# Altium project PCB-Relay-Board-V1.PrjPcb (part 1 of 3)
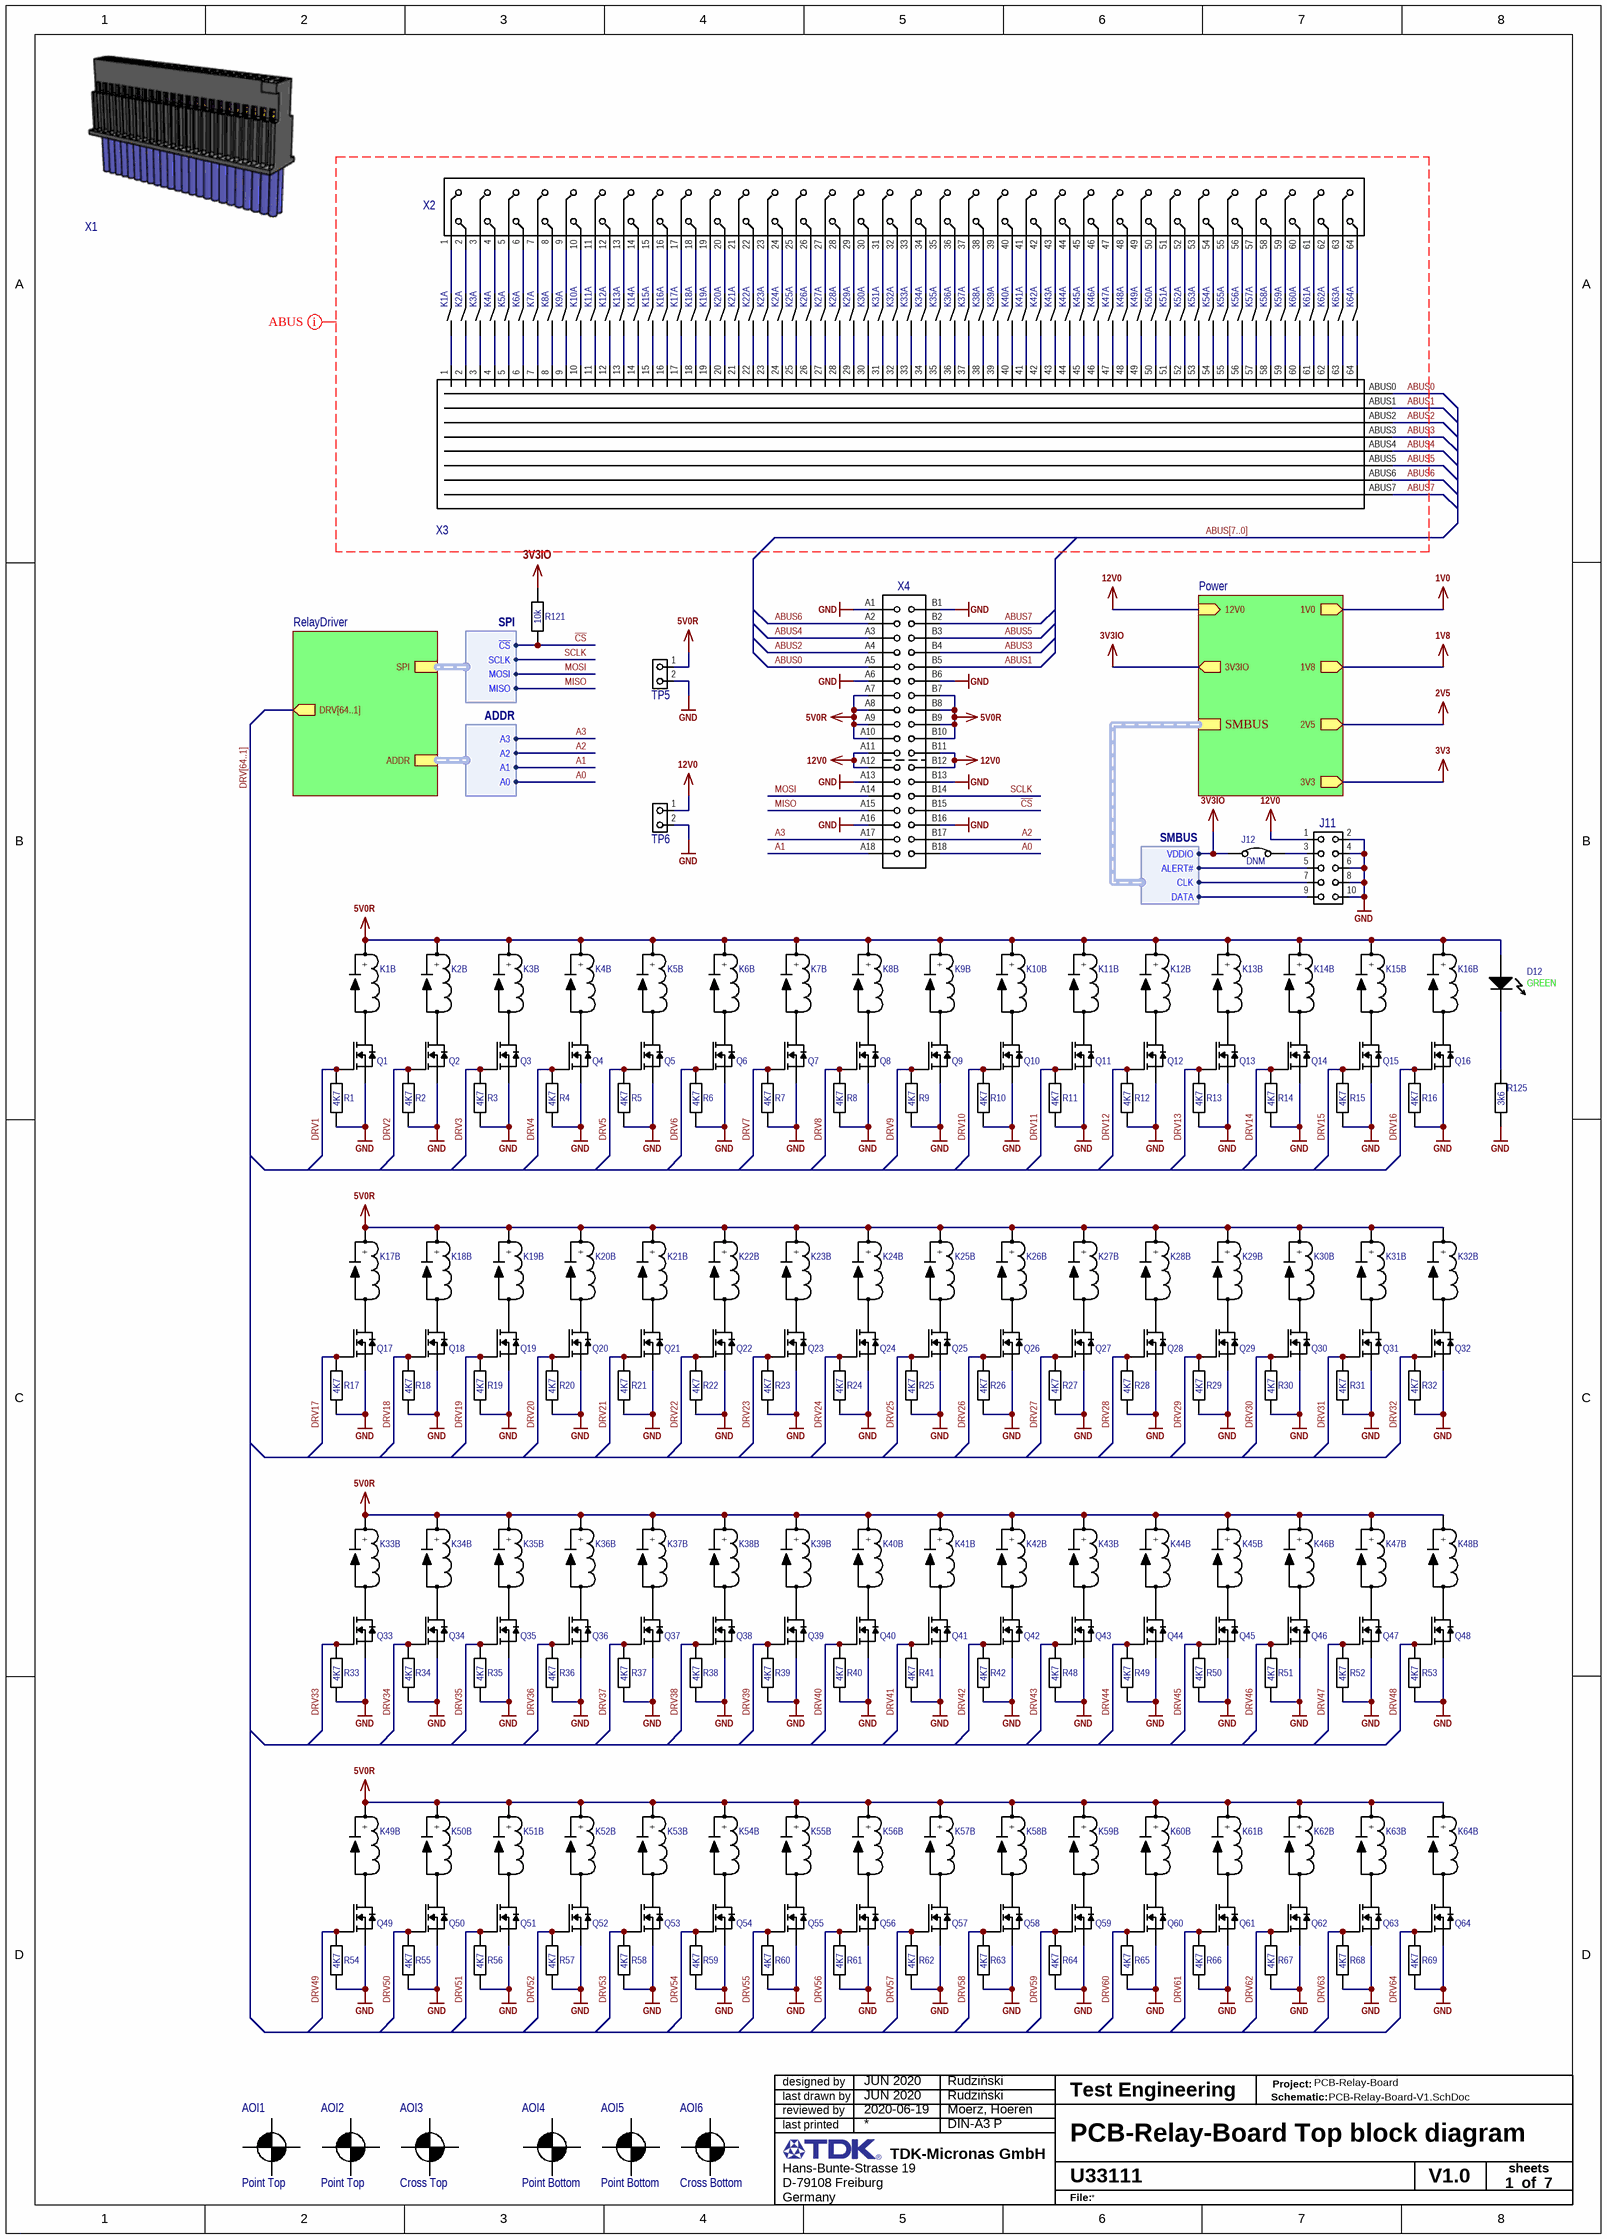
[diagram p0: PCB-Relay-Board-V1.SchDoc]
A_Number: PCB-Tester; Board: PCB-Relay-Board; CheckedBy: Mörz; DocumentNumber: U33111; DrawnBy: Rudziński; Engineer: Hören; MajorRevision: 1; MinorRevision: 0; Project: PCB-Relay-Board; Project_Name: PCB-Relay-Board; Project_Number: U33111; Revision: V1.0; Team: Test Engineering; U_Number: U33111
7 sheets, 429 parts. Net scope: hierarchical (ports join the sheet entries above them; power ports are global).
Board file: PCB-Relay-Board-V1.PcbDoc
Sheets:
  PCB-Relay-Board-V1.SchDoc
    Power = Power.SchDoc
    RelayDriver = RelayDriver.SchDoc
      X7A15T-Prog = X7A15T-Prog.SchDoc
      X7A15T-Fabric = X7A15T-Fabric.SchDoc
      X7A15T-Power = X7A15T-Power.SchDoc
        X7A15T-Decoupling = X7A15T-Decoupling.SchDoc

## Sheet PCB-Relay-Board-V1.SchDoc: PCB-Relay-Board Top block diagram
size A3 portrait; Date: JUN 2020; CheckedBy: Moerz, Hoeren; Author: Rudziński; CompanyName: TDK-Micronas GmbH; DrawnBy: Rudziński; Engineer: Rudziński; Organization: Test Engineering; Address1: Hans-Bunte-Strasse 19; Address2: D-79108 Freiburg; Address3: Germany; DocumentNumber: U33111; Revision: V1.0; SheetNumber: 1; SheetTotal: 7; DateDraw: JUN 2020; DateChecked: 2020-06-19; Workspace: Workspace; TitleTyp: Title-Typ; PageSetup: Record=PageOptions|CenterHorizontal=True|CenterVertical=True|PrintScale=0.97|XCorrection=1.00|YCorrection=1.00|PrintKind=0|BorderSize=5000000|LeftOffset=0|BottomOffset=0|Orientation=2|PaperLength=1000|PaperWidth=1000|Scale=100|PaperSource=7|PrintQuality=-3|MediaType=1|DitherType=10|PrintScaleMode=1|PaperKind=A4|PaperIndex=9

### Parts
AOI1  Shape: Point Top  [Fiducial Point]  (hidden comment: AOI)  (no BOM)
AOI2  Shape: Point Top  [Fiducial Point]  (hidden comment: AOI)  (no BOM)
AOI3  Shape: Cross Top  [Fiducial Cross]  (hidden comment: AOI)  (no BOM)
AOI4  Shape: Point Bottom  [Fiducial Point]  (hidden comment: AOI)  (no BOM)
AOI5  Shape: Point Bottom  [Fiducial Point]  (hidden comment: AOI)  (no BOM)
AOI6  Shape: Cross Bottom  [Fiducial Cross]  (hidden comment: AOI)  (no BOM)
D12  Color: GREEN  [L0603G]  (hidden comment: D)
J11  J  [Header 100mil 5x2]  (value not drawn)
J12  value DNM  [JumperSMD]  (hidden comment: J)  (no BOM)
K1  K  [118-1A]  (value not drawn)  (parts A,B of 2)
K2  K  [118-1A]  (value not drawn)  (parts A,B of 2)
K3  K  [118-1A]  (value not drawn)  (parts A,B of 2)
K4  K  [118-1A]  (value not drawn)  (parts A,B of 2)
K5  K  [118-1A]  (value not drawn)  (parts A,B of 2)
K6  K  [118-1A]  (value not drawn)  (parts A,B of 2)
K7  K  [118-1A]  (value not drawn)  (parts A,B of 2)
K8  K  [118-1A]  (value not drawn)  (parts A,B of 2)
K9  K  [118-1A]  (value not drawn)  (parts A,B of 2)
K10  K  [118-1A]  (value not drawn)  (parts A,B of 2)
K11  K  [118-1A]  (value not drawn)  (parts A,B of 2)
K12  K  [118-1A]  (value not drawn)  (parts A,B of 2)
K13  K  [118-1A]  (value not drawn)  (parts A,B of 2)
K14  K  [118-1A]  (value not drawn)  (parts A,B of 2)
K15  K  [118-1A]  (value not drawn)  (parts A,B of 2)
K16  K  [118-1A]  (value not drawn)  (parts A,B of 2)
K17  K  [118-1A]  (value not drawn)  (parts A,B of 2)
K18  K  [118-1A]  (value not drawn)  (parts A,B of 2)
K19  K  [118-1A]  (value not drawn)  (parts A,B of 2)
K20  K  [118-1A]  (value not drawn)  (parts A,B of 2)
K21  K  [118-1A]  (value not drawn)  (parts A,B of 2)
K22  K  [118-1A]  (value not drawn)  (parts A,B of 2)
K23  K  [118-1A]  (value not drawn)  (parts A,B of 2)
K24  K  [118-1A]  (value not drawn)  (parts A,B of 2)
K25  K  [118-1A]  (value not drawn)  (parts A,B of 2)
K26  K  [118-1A]  (value not drawn)  (parts A,B of 2)
K27  K  [118-1A]  (value not drawn)  (parts A,B of 2)
K28  K  [118-1A]  (value not drawn)  (parts A,B of 2)
K29  K  [118-1A]  (value not drawn)  (parts A,B of 2)
K30  K  [118-1A]  (value not drawn)  (parts A,B of 2)
K31  K  [118-1A]  (value not drawn)  (parts A,B of 2)
K32  K  [118-1A]  (value not drawn)  (parts A,B of 2)
K33  K  [118-1A]  (value not drawn)  (parts A,B of 2)
K34  K  [118-1A]  (value not drawn)  (parts A,B of 2)
K35  K  [118-1A]  (value not drawn)  (parts A,B of 2)
K36  K  [118-1A]  (value not drawn)  (parts A,B of 2)
K37  K  [118-1A]  (value not drawn)  (parts A,B of 2)
K38  K  [118-1A]  (value not drawn)  (parts A,B of 2)
K39  K  [118-1A]  (value not drawn)  (parts A,B of 2)
K40  K  [118-1A]  (value not drawn)  (parts A,B of 2)
K41  K  [118-1A]  (value not drawn)  (parts A,B of 2)
K42  K  [118-1A]  (value not drawn)  (parts A,B of 2)
K43  K  [118-1A]  (value not drawn)  (parts A,B of 2)
K44  K  [118-1A]  (value not drawn)  (parts A,B of 2)
K45  K  [118-1A]  (value not drawn)  (parts A,B of 2)
K46  K  [118-1A]  (value not drawn)  (parts A,B of 2)
K47  K  [118-1A]  (value not drawn)  (parts A,B of 2)
K48  K  [118-1A]  (value not drawn)  (parts A,B of 2)
K49  K  [118-1A]  (value not drawn)  (parts A,B of 2)
K50  K  [118-1A]  (value not drawn)  (parts A,B of 2)
K51  K  [118-1A]  (value not drawn)  (parts A,B of 2)
K52  K  [118-1A]  (value not drawn)  (parts A,B of 2)
K53  K  [118-1A]  (value not drawn)  (parts A,B of 2)
K54  K  [118-1A]  (value not drawn)  (parts A,B of 2)
K55  K  [118-1A]  (value not drawn)  (parts A,B of 2)
K56  K  [118-1A]  (value not drawn)  (parts A,B of 2)
K57  K  [118-1A]  (value not drawn)  (parts A,B of 2)
K58  K  [118-1A]  (value not drawn)  (parts A,B of 2)
K59  K  [118-1A]  (value not drawn)  (parts A,B of 2)
K60  K  [118-1A]  (value not drawn)  (parts A,B of 2)
K61  K  [118-1A]  (value not drawn)  (parts A,B of 2)
K62  K  [118-1A]  (value not drawn)  (parts A,B of 2)
K63  K  [118-1A]  (value not drawn)  (parts A,B of 2)
K64  K  [118-1A]  (value not drawn)  (parts A,B of 2)
Q1  Q  [SOT23-3]  (value not drawn)
Q2  Q  [SOT23-3]  (value not drawn)
Q3  Q  [SOT23-3]  (value not drawn)
Q4  Q  [SOT23-3]  (value not drawn)
Q5  Q  [SOT23-3]  (value not drawn)
Q6  Q  [SOT23-3]  (value not drawn)
Q7  Q  [SOT23-3]  (value not drawn)
Q8  Q  [SOT23-3]  (value not drawn)
Q9  Q  [SOT23-3]  (value not drawn)
Q10  Q  [SOT23-3]  (value not drawn)
Q11  Q  [SOT23-3]  (value not drawn)
Q12  Q  [SOT23-3]  (value not drawn)
Q13  Q  [SOT23-3]  (value not drawn)
Q14  Q  [SOT23-3]  (value not drawn)
Q15  Q  [SOT23-3]  (value not drawn)
Q16  Q  [SOT23-3]  (value not drawn)
Q17  Q  [SOT23-3]  (value not drawn)
Q18  Q  [SOT23-3]  (value not drawn)
Q19  Q  [SOT23-3]  (value not drawn)
Q20  Q  [SOT23-3]  (value not drawn)
Q21  Q  [SOT23-3]  (value not drawn)
Q22  Q  [SOT23-3]  (value not drawn)
Q23  Q  [SOT23-3]  (value not drawn)
Q24  Q  [SOT23-3]  (value not drawn)
Q25  Q  [SOT23-3]  (value not drawn)
Q26  Q  [SOT23-3]  (value not drawn)
Q27  Q  [SOT23-3]  (value not drawn)
Q28  Q  [SOT23-3]  (value not drawn)
Q29  Q  [SOT23-3]  (value not drawn)
Q30  Q  [SOT23-3]  (value not drawn)
Q31  Q  [SOT23-3]  (value not drawn)
Q32  Q  [SOT23-3]  (value not drawn)
Q33  Q  [SOT23-3]  (value not drawn)
Q34  Q  [SOT23-3]  (value not drawn)
Q35  Q  [SOT23-3]  (value not drawn)
Q36  Q  [SOT23-3]  (value not drawn)
Q37  Q  [SOT23-3]  (value not drawn)
Q38  Q  [SOT23-3]  (value not drawn)
Q39  Q  [SOT23-3]  (value not drawn)
Q40  Q  [SOT23-3]  (value not drawn)
Q41  Q  [SOT23-3]  (value not drawn)
Q42  Q  [SOT23-3]  (value not drawn)
Q43  Q  [SOT23-3]  (value not drawn)
Q44  Q  [SOT23-3]  (value not drawn)
Q45  Q  [SOT23-3]  (value not drawn)
Q46  Q  [SOT23-3]  (value not drawn)
Q47  Q  [SOT23-3]  (value not drawn)
Q48  Q  [SOT23-3]  (value not drawn)
Q49  Q  [SOT23-3]  (value not drawn)
Q50  Q  [SOT23-3]  (value not drawn)
Q51  Q  [SOT23-3]  (value not drawn)
Q52  Q  [SOT23-3]  (value not drawn)
Q53  Q  [SOT23-3]  (value not drawn)
Q54  Q  [SOT23-3]  (value not drawn)
Q55  Q  [SOT23-3]  (value not drawn)
Q56  Q  [SOT23-3]  (value not drawn)
Q57  Q  [SOT23-3]  (value not drawn)
Q58  Q  [SOT23-3]  (value not drawn)
Q59  Q  [SOT23-3]  (value not drawn)
Q60  Q  [SOT23-3]  (value not drawn)
Q61  Q  [SOT23-3]  (value not drawn)
Q62  Q  [SOT23-3]  (value not drawn)
Q63  Q  [SOT23-3]  (value not drawn)
Q64  Q  [SOT23-3]  (value not drawn)
R1  value 4K7  [R0402 Reflow]  (hidden comment: R)
R2  value 4K7  [R0402 Reflow]  (hidden comment: R)
R3  value 4K7  [R0402 Reflow]  (hidden comment: R)
R4  value 4K7  [R0402 Reflow]  (hidden comment: R)
R5  value 4K7  [R0402 Reflow]  (hidden comment: R)
R6  value 4K7  [R0402 Reflow]  (hidden comment: R)
R7  value 4K7  [R0402 Reflow]  (hidden comment: R)
R8  value 4K7  [R0402 Reflow]  (hidden comment: R)
R9  value 4K7  [R0402 Reflow]  (hidden comment: R)
R10  value 4K7  [R0402 Reflow]  (hidden comment: R)
R11  value 4K7  [R0402 Reflow]  (hidden comment: R)
R12  value 4K7  [R0402 Reflow]  (hidden comment: R)
R13  value 4K7  [R0402 Reflow]  (hidden comment: R)
R14  value 4K7  [R0402 Reflow]  (hidden comment: R)
R15  value 4K7  [R0402 Reflow]  (hidden comment: R)
R16  value 4K7  [R0402 Reflow]  (hidden comment: R)
R17  value 4K7  [R0402 Reflow]  (hidden comment: R)
R18  value 4K7  [R0402 Reflow]  (hidden comment: R)
R19  value 4K7  [R0402 Reflow]  (hidden comment: R)
R20  value 4K7  [R0402 Reflow]  (hidden comment: R)
R21  value 4K7  [R0402 Reflow]  (hidden comment: R)
R22  value 4K7  [R0402 Reflow]  (hidden comment: R)
R23  value 4K7  [R0402 Reflow]  (hidden comment: R)
R24  value 4K7  [R0402 Reflow]  (hidden comment: R)
R25  value 4K7  [R0402 Reflow]  (hidden comment: R)
R26  value 4K7  [R0402 Reflow]  (hidden comment: R)
R27  value 4K7  [R0402 Reflow]  (hidden comment: R)
R28  value 4K7  [R0402 Reflow]  (hidden comment: R)
R29  value 4K7  [R0402 Reflow]  (hidden comment: R)
R30  value 4K7  [R0402 Reflow]  (hidden comment: R)
R31  value 4K7  [R0402 Reflow]  (hidden comment: R)
R32  value 4K7  [R0402 Reflow]  (hidden comment: R)
R33  value 4K7  [R0402 Reflow]  (hidden comment: R)
R34  value 4K7  [R0402 Reflow]  (hidden comment: R)
R35  value 4K7  [R0402 Reflow]  (hidden comment: R)
R36  value 4K7  [R0402 Reflow]  (hidden comment: R)
R37  value 4K7  [R0402 Reflow]  (hidden comment: R)
R38  value 4K7  [R0402 Reflow]  (hidden comment: R)
R39  value 4K7  [R0402 Reflow]  (hidden comment: R)
R40  value 4K7  [R0402 Reflow]  (hidden comment: R)
R41  value 4K7  [R0402 Reflow]  (hidden comment: R)
R42  value 4K7  [R0402 Reflow]  (hidden comment: R)
R48  value 4K7  [R0402 Reflow]  (hidden comment: R)
R49  value 4K7  [R0402 Reflow]  (hidden comment: R)
R50  value 4K7  [R0402 Reflow]  (hidden comment: R)
R51  value 4K7  [R0402 Reflow]  (hidden comment: R)
R52  value 4K7  [R0402 Reflow]  (hidden comment: R)
R53  value 4K7  [R0402 Reflow]  (hidden comment: R)
R54  value 4K7  [R0402 Reflow]  (hidden comment: R)
R55  value 4K7  [R0402 Reflow]  (hidden comment: R)
R56  value 4K7  [R0402 Reflow]  (hidden comment: R)
R57  value 4K7  [R0402 Reflow]  (hidden comment: R)
R58  value 4K7  [R0402 Reflow]  (hidden comment: R)
R59  value 4K7  [R0402 Reflow]  (hidden comment: R)
R60  value 4K7  [R0402 Reflow]  (hidden comment: R)
R61  value 4K7  [R0402 Reflow]  (hidden comment: R)
R62  value 4K7  [R0402 Reflow]  (hidden comment: R)
R63  value 4K7  [R0402 Reflow]  (hidden comment: R)
R64  value 4K7  [R0402 Reflow]  (hidden comment: R)
R65  value 4K7  [R0402 Reflow]  (hidden comment: R)
R66  value 4K7  [R0402 Reflow]  (hidden comment: R)
R67  value 4K7  [R0402 Reflow]  (hidden comment: R)
R68  value 4K7  [R0402 Reflow]  (hidden comment: R)
R69  value 4K7  [R0402 Reflow]  (hidden comment: R)
R121  value 10k  [R0402 Reflow]  (hidden comment: R)
R125  value 3k6  [R0603 Reflow]  (hidden comment: R)
TP5  TP  [DualTestpoint 100mils]  (value not drawn)  (no BOM)
TP6  TP  [DualTestpoint 100mils]  (value not drawn)  (no BOM)
X1  X  (value not drawn)
X2  X  [TFC-132-01-F-D-RA]  (value not drawn)
X3  X  [CONFIG64]  (value not drawn)  (no BOM)
X4  X  [PCIE-036-02-F-D-Fingers]  (value not drawn)  (no BOM)

### Sub-sheets
Power = Power.SchDoc: 2V5 (out), 3V3 (out), 12V0 (in), 1V0 (out), 1V8 (out), SMBUS (harness SMBUS), 3V3IO (out)
RelayDriver = RelayDriver.SchDoc: SPI (harness SPI), ADDR (harness ADDR), DRV[64..1] (out)

### Harnesses
SPI: MISO, MOSI, SCLK, ~{CS}
ADDR: A3, A2, A1, A0
SMBUS: ALERT#, CLK, DATA, VDDIO

### Nets
3V3IO: J12.1 R121.2 ; sheet Power/3V3IO, sheet Power/SMBUS.VDDIO
5V0R: D12.1(Anode) K1.1(+) K2.1(+) K3.1(+) K4.1(+) K5.1(+) K6.1(+) K7.1(+) K8.1(+) K9.1(+) K10.1(+) K11.1(+) K12.1(+) K13.1(+) K14.1(+) K15.1(+) K16.1(+) K17.1(+) K18.1(+) K19.1(+) K20.1(+) K21.1(+) K22.1(+) K23.1(+) K24.1(+) K25.1(+) K26.1(+) K27.1(+) K28.1(+) K29.1(+) K30.1(+) K31.1(+) K32.1(+) K33.1(+) K34.1(+) K35.1(+) K36.1(+) K37.1(+) K38.1(+) K39.1(+) K40.1(+) K41.1(+) K42.1(+) K43.1(+) K44.1(+) K45.1(+) K46.1(+) K47.1(+) K48.1(+) K49.1(+) K50.1(+) K51.1(+) K52.1(+) K53.1(+) K54.1(+) K55.1(+) K56.1(+) K57.1(+) K58.1(+) K59.1(+) K60.1(+) K61.1(+) K62.1(+) K63.1(+) K64.1(+) TP5.1 X4.A7 X4.A8 X4.A9 X4.A10 X4.B7 X4.B8 X4.B9 X4.B10
12V0: J11.1 TP6.1 X4.A11 X4.A12 X4.B11 X4.B12 ; sheet Power/12V0
GND: J11.2 J11.4 J11.6 J11.8 J11.10 Q1.2(S) Q2.2(S) Q3.2(S) Q4.2(S) Q5.2(S) Q6.2(S) Q7.2(S) Q8.2(S) Q9.2(S) Q10.2(S) Q11.2(S) Q12.2(S) Q13.2(S) Q14.2(S) Q15.2(S) Q16.2(S) Q17.2(S) Q18.2(S) Q19.2(S) Q20.2(S) Q21.2(S) Q22.2(S) Q23.2(S) Q24.2(S) Q25.2(S) Q26.2(S) Q27.2(S) Q28.2(S) Q29.2(S) Q30.2(S) Q31.2(S) Q32.2(S) Q33.2(S) Q34.2(S) Q35.2(S) Q36.2(S) Q37.2(S) Q38.2(S) Q39.2(S) Q40.2(S) Q41.2(S) Q42.2(S) Q43.2(S) Q44.2(S) Q45.2(S) Q46.2(S) Q47.2(S) Q48.2(S) Q49.2(S) Q50.2(S) Q51.2(S) Q52.2(S) Q53.2(S) Q54.2(S) Q55.2(S) Q56.2(S) Q57.2(S) Q58.2(S) Q59.2(S) Q60.2(S) Q61.2(S) Q62.2(S) Q63.2(S) Q64.2(S) R1.1 R2.1 R3.1 R4.1 R5.1 R6.1 R7.1 R8.1 R9.1 R10.1 R11.1 R12.1 R13.1 R14.1 R15.1 R16.1 R17.1 R18.1 R19.1 R20.1 R21.1 R22.1 R23.1 R24.1 R25.1 R26.1 R27.1 R28.1 R29.1 R30.1 R31.1 R32.1 R33.1 R34.1 R35.1 R36.1 R37.1 R38.1 R39.1 R40.1 R41.1 R42.1 R48.1 R49.1 R50.1 R51.1 R52.1 R53.1 R54.1 R55.1 R56.1 R57.1 R58.1 R59.1 R60.1 R61.1 R62.1 R63.1 R64.1 R65.1 R66.1 R67.1 R68.1 R69.1 R125.1 TP5.2 TP6.2 X4.A1 X4.A6 X4.A13 X4.A16 X4.B1 X4.B6 X4.B13 X4.B16
~{CS}: R121.1 X4.B15 ; sheet RelayDriver/SPI.~{CS}
A0: X4.B18 ; sheet RelayDriver/ADDR.A0
A1: X4.A18 ; sheet RelayDriver/ADDR.A1
A2: X4.B17 ; sheet RelayDriver/ADDR.A2
A3: X4.A17 ; sheet RelayDriver/ADDR.A3
ABUS0: X3.ABUS0 X4.A5  [project net ABUS0_1]
ABUS1: X3.ABUS1 X4.B5  [project net ABUS1_1]
ABUS2: X3.ABUS2 X4.A4  [project net ABUS2_1]
ABUS3: X3.ABUS3 X4.B4  [project net ABUS3_1]
ABUS4: X3.ABUS4 X4.A3  [project net ABUS4_1]
ABUS5: X3.ABUS5 X4.B3  [project net ABUS5_1]
ABUS6: X3.ABUS6 X4.A2  [project net ABUS6_1]
ABUS7: X3.ABUS7 X4.B2  [project net ABUS7_1]
DRV1: Q1.1(G) R1.2
DRV2: Q2.1(G) R2.2
DRV3: Q3.1(G) R3.2
DRV4: Q4.1(G) R4.2
DRV5: Q5.1(G) R5.2
DRV6: Q6.1(G) R6.2
DRV7: Q7.1(G) R7.2
DRV8: Q8.1(G) R8.2
DRV9: Q9.1(G) R9.2
DRV10: Q10.1(G) R10.2
DRV11: Q11.1(G) R11.2
DRV12: Q12.1(G) R12.2
DRV13: Q13.1(G) R13.2
DRV14: Q14.1(G) R14.2
DRV15: Q15.1(G) R15.2
DRV16: Q16.1(G) R16.2
DRV17: Q17.1(G) R17.2
DRV18: Q18.1(G) R18.2
DRV19: Q19.1(G) R19.2
DRV20: Q20.1(G) R20.2
DRV21: Q21.1(G) R21.2
DRV22: Q22.1(G) R22.2
DRV23: Q23.1(G) R23.2
DRV24: Q24.1(G) R24.2
DRV25: Q25.1(G) R25.2
DRV26: Q26.1(G) R26.2
DRV27: Q27.1(G) R27.2
DRV28: Q28.1(G) R28.2
DRV29: Q29.1(G) R29.2
DRV30: Q30.1(G) R30.2
DRV31: Q31.1(G) R31.2
DRV32: Q32.1(G) R32.2
DRV33: Q33.1(G) R33.2
DRV34: Q34.1(G) R34.2
DRV35: Q35.1(G) R35.2
DRV36: Q36.1(G) R36.2
DRV37: Q37.1(G) R37.2
DRV38: Q38.1(G) R38.2
DRV39: Q39.1(G) R39.2
DRV40: Q40.1(G) R40.2
DRV41: Q41.1(G) R41.2
DRV42: Q42.1(G) R42.2
DRV43: Q43.1(G) R48.2
DRV44: Q44.1(G) R49.2
DRV45: Q45.1(G) R50.2
DRV46: Q46.1(G) R51.2
DRV47: Q47.1(G) R52.2
DRV48: Q48.1(G) R53.2
DRV49: Q49.1(G) R54.2
DRV50: Q50.1(G) R55.2
DRV51: Q51.1(G) R56.2
DRV52: Q52.1(G) R57.2
DRV53: Q53.1(G) R58.2
DRV54: Q54.1(G) R59.2
DRV55: Q55.1(G) R60.2
DRV56: Q56.1(G) R61.2
DRV57: Q57.1(G) R62.2
DRV58: Q58.1(G) R63.2
DRV59: Q59.1(G) R64.2
DRV60: Q60.1(G) R65.2
DRV61: Q61.1(G) R66.2
DRV62: Q62.1(G) R67.2
DRV63: Q63.1(G) R68.2
DRV64: Q64.1(G) R69.2
MISO: X4.A15 ; sheet RelayDriver/SPI.MISO
MOSI: X4.A14 ; sheet RelayDriver/SPI.MOSI
SCLK: X4.B14 ; sheet RelayDriver/SPI.SCLK
NetD12_2: D12.2(Cathode) R125.2
NetJ11_3: J11.3 J12.2
NetJ11_5: J11.5 ; sheet Power/SMBUS.ALERT#
NetJ11_7: J11.7 ; sheet Power/SMBUS.CLK
NetJ11_9: J11.9 ; sheet Power/SMBUS.DATA
NetK1_2: K1.2(-) Q1.3(D)
NetK1_3: K1.3(CA) X3.1
NetK1_4: K1.4(CB) X2.1
NetK2_2: K2.2(-) Q2.3(D)
NetK2_3: K2.3(CA) X3.2
NetK2_4: K2.4(CB) X2.2
NetK3_2: K3.2(-) Q3.3(D)
NetK3_3: K3.3(CA) X3.3
NetK3_4: K3.4(CB) X2.3
NetK4_2: K4.2(-) Q4.3(D)
NetK4_3: K4.3(CA) X3.4
NetK4_4: K4.4(CB) X2.4
NetK5_2: K5.2(-) Q5.3(D)
NetK5_3: K5.3(CA) X3.5
NetK5_4: K5.4(CB) X2.5
NetK6_2: K6.2(-) Q6.3(D)
NetK6_3: K6.3(CA) X3.6
NetK6_4: K6.4(CB) X2.6
NetK7_2: K7.2(-) Q7.3(D)
NetK7_3: K7.3(CA) X3.7
NetK7_4: K7.4(CB) X2.7
NetK8_2: K8.2(-) Q8.3(D)
NetK8_3: K8.3(CA) X3.8
NetK8_4: K8.4(CB) X2.8
NetK9_2: K9.2(-) Q9.3(D)
NetK9_3: K9.3(CA) X3.9
NetK9_4: K9.4(CB) X2.9
NetK10_2: K10.2(-) Q10.3(D)
NetK10_3: K10.3(CA) X3.10
NetK10_4: K10.4(CB) X2.10
NetK11_2: K11.2(-) Q11.3(D)
NetK11_3: K11.3(CA) X3.11
NetK11_4: K11.4(CB) X2.11
NetK12_2: K12.2(-) Q12.3(D)
NetK12_3: K12.3(CA) X3.12
NetK12_4: K12.4(CB) X2.12
NetK13_2: K13.2(-) Q13.3(D)
NetK13_3: K13.3(CA) X3.13
NetK13_4: K13.4(CB) X2.13
NetK14_2: K14.2(-) Q14.3(D)
NetK14_3: K14.3(CA) X3.14
NetK14_4: K14.4(CB) X2.14
NetK15_2: K15.2(-) Q15.3(D)
NetK15_3: K15.3(CA) X3.15
NetK15_4: K15.4(CB) X2.15
NetK16_2: K16.2(-) Q16.3(D)
NetK16_3: K16.3(CA) X3.16
NetK16_4: K16.4(CB) X2.16
NetK17_2: K17.2(-) Q17.3(D)
NetK17_3: K17.3(CA) X3.17
NetK17_4: K17.4(CB) X2.17
NetK18_2: K18.2(-) Q18.3(D)
NetK18_3: K18.3(CA) X3.18
NetK18_4: K18.4(CB) X2.18
NetK19_2: K19.2(-) Q19.3(D)
NetK19_3: K19.3(CA) X3.19
NetK19_4: K19.4(CB) X2.19
NetK20_2: K20.2(-) Q20.3(D)
NetK20_3: K20.3(CA) X3.20
NetK20_4: K20.4(CB) X2.20
NetK21_2: K21.2(-) Q21.3(D)
NetK21_3: K21.3(CA) X3.21
NetK21_4: K21.4(CB) X2.21
NetK22_2: K22.2(-) Q22.3(D)
NetK22_3: K22.3(CA) X3.22
NetK22_4: K22.4(CB) X2.22
NetK23_2: K23.2(-) Q23.3(D)
NetK23_3: K23.3(CA) X3.23
NetK23_4: K23.4(CB) X2.23
NetK24_2: K24.2(-) Q24.3(D)
NetK24_3: K24.3(CA) X3.24
NetK24_4: K24.4(CB) X2.24
NetK25_2: K25.2(-) Q25.3(D)
NetK25_3: K25.3(CA) X3.25
NetK25_4: K25.4(CB) X2.25
NetK26_2: K26.2(-) Q26.3(D)
NetK26_3: K26.3(CA) X3.26
NetK26_4: K26.4(CB) X2.26
NetK27_2: K27.2(-) Q27.3(D)
NetK27_3: K27.3(CA) X3.27
NetK27_4: K27.4(CB) X2.27
NetK28_2: K28.2(-) Q28.3(D)
NetK28_3: K28.3(CA) X3.28
NetK28_4: K28.4(CB) X2.28
NetK29_2: K29.2(-) Q29.3(D)
NetK29_3: K29.3(CA) X3.29
NetK29_4: K29.4(CB) X2.29
NetK30_2: K30.2(-) Q30.3(D)
NetK30_3: K30.3(CA) X3.30
NetK30_4: K30.4(CB) X2.30
NetK31_2: K31.2(-) Q31.3(D)
NetK31_3: K31.3(CA) X3.31
NetK31_4: K31.4(CB) X2.31
NetK32_2: K32.2(-) Q32.3(D)
NetK32_3: K32.3(CA) X3.32
NetK32_4: K32.4(CB) X2.32
NetK33_2: K33.2(-) Q33.3(D)
NetK33_3: K33.3(CA) X3.33
NetK33_4: K33.4(CB) X2.33
NetK34_2: K34.2(-) Q34.3(D)
NetK34_3: K34.3(CA) X3.34
NetK34_4: K34.4(CB) X2.34
NetK35_2: K35.2(-) Q35.3(D)
NetK35_3: K35.3(CA) X3.35
NetK35_4: K35.4(CB) X2.35
NetK36_2: K36.2(-) Q36.3(D)
NetK36_3: K36.3(CA) X3.36
NetK36_4: K36.4(CB) X2.36
NetK37_2: K37.2(-) Q37.3(D)
NetK37_3: K37.3(CA) X3.37
NetK37_4: K37.4(CB) X2.37
NetK38_2: K38.2(-) Q38.3(D)
NetK38_3: K38.3(CA) X3.38
NetK38_4: K38.4(CB) X2.38
NetK39_2: K39.2(-) Q39.3(D)
NetK39_3: K39.3(CA) X3.39
NetK39_4: K39.4(CB) X2.39
NetK40_2: K40.2(-) Q40.3(D)
NetK40_3: K40.3(CA) X3.40
NetK40_4: K40.4(CB) X2.40
NetK41_2: K41.2(-) Q41.3(D)
NetK41_3: K41.3(CA) X3.41
NetK41_4: K41.4(CB) X2.41
NetK42_2: K42.2(-) Q42.3(D)
NetK42_3: K42.3(CA) X3.42
NetK42_4: K42.4(CB) X2.42
NetK43_2: K43.2(-) Q43.3(D)
NetK43_3: K43.3(CA) X3.43
NetK43_4: K43.4(CB) X2.43
NetK44_2: K44.2(-) Q44.3(D)
NetK44_3: K44.3(CA) X3.44
NetK44_4: K44.4(CB) X2.44
NetK45_2: K45.2(-) Q45.3(D)
NetK45_3: K45.3(CA) X3.45
NetK45_4: K45.4(CB) X2.45
NetK46_2: K46.2(-) Q46.3(D)
NetK46_3: K46.3(CA) X3.46
NetK46_4: K46.4(CB) X2.46
NetK47_2: K47.2(-) Q47.3(D)
NetK47_3: K47.3(CA) X3.47
NetK47_4: K47.4(CB) X2.47
NetK48_2: K48.2(-) Q48.3(D)
NetK48_3: K48.3(CA) X3.48
NetK48_4: K48.4(CB) X2.48
NetK49_2: K49.2(-) Q49.3(D)
NetK49_3: K49.3(CA) X3.49
NetK49_4: K49.4(CB) X2.49
NetK50_2: K50.2(-) Q50.3(D)
NetK50_3: K50.3(CA) X3.50
NetK50_4: K50.4(CB) X2.50
NetK51_2: K51.2(-) Q51.3(D)
NetK51_3: K51.3(CA) X3.51
NetK51_4: K51.4(CB) X2.51
NetK52_2: K52.2(-) Q52.3(D)
NetK52_3: K52.3(CA) X3.52
NetK52_4: K52.4(CB) X2.52
NetK53_2: K53.2(-) Q53.3(D)
NetK53_3: K53.3(CA) X3.53
NetK53_4: K53.4(CB) X2.53
NetK54_2: K54.2(-) Q54.3(D)
NetK54_3: K54.3(CA) X3.54
NetK54_4: K54.4(CB) X2.54
NetK55_2: K55.2(-) Q55.3(D)
NetK55_3: K55.3(CA) X3.55
NetK55_4: K55.4(CB) X2.55
NetK56_2: K56.2(-) Q56.3(D)
NetK56_3: K56.3(CA) X3.56
NetK56_4: K56.4(CB) X2.56
NetK57_2: K57.2(-) Q57.3(D)
NetK57_3: K57.3(CA) X3.57
NetK57_4: K57.4(CB) X2.57
NetK58_2: K58.2(-) Q58.3(D)
NetK58_3: K58.3(CA) X3.58
NetK58_4: K58.4(CB) X2.58
NetK59_2: K59.2(-) Q59.3(D)
NetK59_3: K59.3(CA) X3.59
NetK59_4: K59.4(CB) X2.59
NetK60_2: K60.2(-) Q60.3(D)
NetK60_3: K60.3(CA) X3.60
NetK60_4: K60.4(CB) X2.60
NetK61_2: K61.2(-) Q61.3(D)
NetK61_3: K61.3(CA) X3.61
NetK61_4: K61.4(CB) X2.61
NetK62_2: K62.2(-) Q62.3(D)
NetK62_3: K62.3(CA) X3.62
NetK62_4: K62.4(CB) X2.62
NetK63_2: K63.2(-) Q63.3(D)
NetK63_3: K63.3(CA) X3.63
NetK63_4: K63.4(CB) X2.63
NetK64_2: K64.2(-) Q64.3(D)
NetK64_3: K64.3(CA) X3.64
NetK64_4: K64.4(CB) X2.64

### Buses and harness runs
bus ABUS[7..0]
bus DRV[64..1] = sheet RelayDriver/DRV[64..1]

### Layout directives
net class ABUS: ABUS0, ABUS1, ABUS2, ABUS3, ABUS4, ABUS5, ABUS6, ABUS7, ABUS[7..0]

### Notes on the sheet
- designed by
- reviewed by
- last drawn by
- Schematic:
- Project:
- last printed
- DIN-A3 P
- sheets
- of
- File:

### Library data of the parts
AOI1-AOI6 = Fiducial: Assembly AOI; 13. Created Date/Name: AUG2018/Hören; 01. Distributor: N/A; 02. Distributor Part Number: N/A; 03. Unit Price: N/A; 04. Manufacturer: N/A; 05. Quantity: N/A; 06. Data Sheet: N/A; 07. Manufacturer  Part Number: N/A; 08. Inhouse Stock: N/A; 09. Operating Temperature: N/A; 10. Weight: N/A; 11. RoHS: N/A; 12.UL94 Flammability: N/A; ComponentLink1Description: Info; ComponentLink2Description: Info
D12 = LED: LED GREEN DIFFUSED 0603 SMD; 04. Manufacturer: OSRAM Opto Semiconductors Inc.; 07. Manufacturer  Part Number: LG L29K-G2J1-24-Z; Vf: 1.7V; If: 2mA; Wave Length: 570nm; Viewing Angle: 160°; 03. Unit Price: 0.4; 13. Created Date/Name: AUG2018/Hören; ComponentLink1Description: Info; ComponentLink1URL: https://www.digikey.de/products/en?keywords=475-2709-6-ND; ComponentLink2Description: DataSheet; ComponentLink2URL: https://www.digikey.de/products/en?keywords=475-2709-6-ND; 02. Distributor Part Number: 475-2709-6-ND; 11. RoHS: YES; 01. Distributor: DigiKey
J11 = Header 5x2Pins 100mil: .100" High-Temp Variable Post Height Terminal Strip; 04. Manufacturer: Samtec Inc.; 07. Manufacturer  Part Number: HMTSW-105-07-G-D-240; 03. Unit Price: 0.843; 13. Created Date/Name: AUG2018/Hören; 01. Distributor: Samtec Inc.; 02. Distributor Part Number: HMTSW-105-07-G-D-240; 11. RoHS: YES; ComponentLink1Description: Info; ComponentLink1URL: https://www.samtec.com/products/hmtsw-103-07-g-s-240; ComponentLink2Description: DataSheet; ComponentLink2URL: http://suddendocs.samtec.com/catalog_english/hmtsw.pdf
J12 = Jumper SMD: RES SMD 0 OHM JUMPER 1/10W 0603; 04. Manufacturer: Yageo; 07. Manufacturer  Part Number: RC0603JR-070RL; 03. Unit Price: 0.09; 01. Distributor: DigiKey; 02. Distributor Part Number: 311-0.0GRDKR-ND; 09. Operating Temperature: -55°C ~ 155°C; 11. RoHS: YES; Package: 0603; ComponentLink4Description: Info; ComponentLink4URL: https://www.digikey.de/product-detail/en/yageo/RC0603JR-070RL/311-0.0GRDKR-ND/732569; ComponentLink5Description: DataSheet; ComponentLink5URL: http://www.yageo.com/documents/recent/PYu-RC_Group_51_RoHS_L_10.pdf
K1-K64 = 118-1-A-5/2D: 5V Signal Relais, Normal Open; 04. Manufacturer: Pickering; 03. Unit Price: 2.60; 05. Quantity: 1000; 06. Data Sheet: Pickering_series_118.pdf; 13. Created Date/Name: 20.12.17 S. Kaiser; Coil Resistance: 1500 Ohm; Max Carry Current: 1.2 A; Max Switch Current: 1A; Max Switch Voltage: 200V; Power Rating: 15W; 01. Distributor: Pickering; 02. Distributor Part Number: 118-1-A-5/2D; 07. Manufacturer  Part Number: 118-1-A-5/2D; 09. Operating Temperature: -20°C ~ +85°C; 11. RoHS: 2011/65/EU; ComponentLink1Description: Info; ComponentLink1URL: http://www.pickeringrelay.com/; ComponentLink2Description: DataSheet; ComponentLink2URL: https://www.pickeringrelay.com/products/single-line-sil-series-111-119/single-line-sil-series-118/; Coil Voltage: 5V
Q1-Q64 = FDV303N: MOSFET N-CH 25V 680MA SOT-23; 04. Manufacturer: ON Semiconductor; 03. Unit Price: 0.41; 13. Created Date/Name: AUG 2018 / Hören; Rds On: 450 mΩ @ id=500mA & Vgs=4.5V; Vgs,th: 1.5V @ 250uA; Power Rating: 350mW; 3D-Export: No; 01. Distributor: DigiKey; 02. Distributor Part Number: FDV303NDKR-ND; 07. Manufacturer  Part Number: FDV303N; 09. Operating Temperature: -55°C ~ 150°C (TJ); 11. RoHS: YES; ComponentLink1Description: Info; ComponentLink1URL: https://www.digikey.de/product-detail/en/on-semiconductor/FDV303N/FDV303NDKR-ND/1630434; ComponentLink2Description: DataSheet; ComponentLink2URL: https://media.digikey.com/pdf/Data%20Sheets/Fairchild%20PDFs/FDV303N.pdf; Vdss: 25V; Id: 680mA
R1-R42 R48-R69 = R: RES SMD 4.7K OHM 1% 1/16W 0402; 04. Manufacturer: Yageo; 07. Manufacturer  Part Number: RC0402FR-074K7L; 03. Unit Price: 0.09; 13. Created Date/Name: AUG2018/Hören; Power Rating: 63mW; Tolerance: ±1%; ComponentLink1URL: https://www.digikey.de/products/en?keywords=311-4.7KLRDKR-ND; ComponentLink1Description: Info; 02. Distributor Part Number: 311-4.7KLRDKR-ND; 09. Operating Temperature: -55°C ~ 155°C; 11. RoHS: YES; 01. Distributor: DigiKey; ComponentLink2Description: DataSheet; Type: Thick Film; Package: 0402
R121 = R: RES SMD 10K OHM 1% 1/16W 0402; 04. Manufacturer: Yageo; 07. Manufacturer  Part Number: RC0402FR-0710KL; 03. Unit Price: 0.09; 13. Created Date/Name: AUG2018/Hören; Tolerance: ±1%; ComponentLink1URL: *; ComponentLink1Description: Info; 02. Distributor Part Number: 311-10.0KLRDKR-ND; 09. Operating Temperature: -xx..+yy°C; 11. RoHS: ???; 01. Distributor: DigiKey; ComponentLink2Description: DataSheet; Package: *
R125 = R: RES SMD 3.6K OHM 1% 1/10W 0603; 04. Manufacturer: Yageo; 07. Manufacturer  Part Number: RC0603FR-073K6L; 03. Unit Price: 0.09; 13. Created Date/Name: AUG2018/Hören; Power Rating: 63mW; Tolerance: ±1%; ComponentLink1URL: https://www.digikey.de/product-detail/en/yageo/RC0402FR-071K65L/YAG3043DKR-ND/5282914; ComponentLink1Description: Info; 02. Distributor Part Number: 311-3.60KHRCT-ND; 09. Operating Temperature: -55°C ~ 155°C; 11. RoHS: YES; 01. Distributor: DigiKey; ComponentLink2Description: DataSheet; Type: Thick Film; Package: 0402
TP5 TP6 = DualTestpoint 100mils: Dual testpoint, pitch 2.54mm; 04. Manufacturer: Samtec Inc.; 07. Manufacturer  Part Number: HMTSW-103-07-G-S-240; 03. Unit Price: 0.25; 13. Created Date/Name: AUG2018/Hören; 01. Distributor: Samtec Inc.; 02. Distributor Part Number: HMTSW-103-07-G-S-240; 11. RoHS: YES; ComponentLink1Description: Info; ComponentLink1URL: https://www.samtec.com/products/hmtsw-103-07-g-s-240; ComponentLink2Description: DataSheet; ComponentLink2URL: http://suddendocs.samtec.com/catalog_english/hmtsw.pdf
X1 = SFSD-32-30C-G-15.00-S: 32 x 2 x 1.27mm SOCKET DISCRETE CABL COLORED; 04. Manufacturer: Samtec Inc.; 03. Unit Price: 10; 13. Created Date/Name: ??? / Hören; 01. Distributor: Samtec Inc.; 02. Distributor Part Number: SFSD-32-30C-G-15.00-S; 07. Manufacturer  Part Number: SFSD-32-30C-G-15.00-S; 11. RoHS: YES; ComponentLink1Description: Info; ComponentLink1URL: https://www.samtec.com/products/sfsd-24-30c-g-15.00-s; ComponentLink2Description: DataSheet
X2 = TFC-132-01-F-D-RA: CONN HEADER TH RA 48POS 1.27MM; 04. Manufacturer: Samtec Inc.; 03. Unit Price: 5; 13. Created Date/Name: ??? / Hören; System: Connector; 01. Distributor: Samtec Inc.; 02. Distributor Part Number: TFC-132-01-F-D-RA; 07. Manufacturer  Part Number: TFC-132-01-F-D-RA; 11. RoHS: YES; ComponentLink1Description: Info; ComponentLink1URL: https://www.samtec.com/products/tfc-124-01-f-d-ra; ComponentLink2Description: DataSheet
X3 = CONFIG64: PCB Tester Configuration Matrix for 48 Relays over 8 ABUSes; 13. Created Date/Name: ??? / Hören; ComponentLink1Description: Info; ComponentLink2Description: DataSheet
X4 = PCIE-036-02-F-D-Fingers: CONN PCI Card Edge 36POS; System: Connector; ComponentLink1Description: Info; ComponentLink2Description: DataSheet; ComponentLink2URL: http://suddendocs.samtec.com/catalog_english/pcie.pdf